# Altium schematic sheet [06] - MOTOR DRIVERS.SchDoc: X
size A4; Date: DD-MM-YYYY; CheckedBy: X; DrawnBy: Y; Revision: 0.0.0; SheetNumber: X; SheetTotal: Y; Projectnumber: OWN-000; Size: A4; Contact: datasystem.pl; Projectname: X
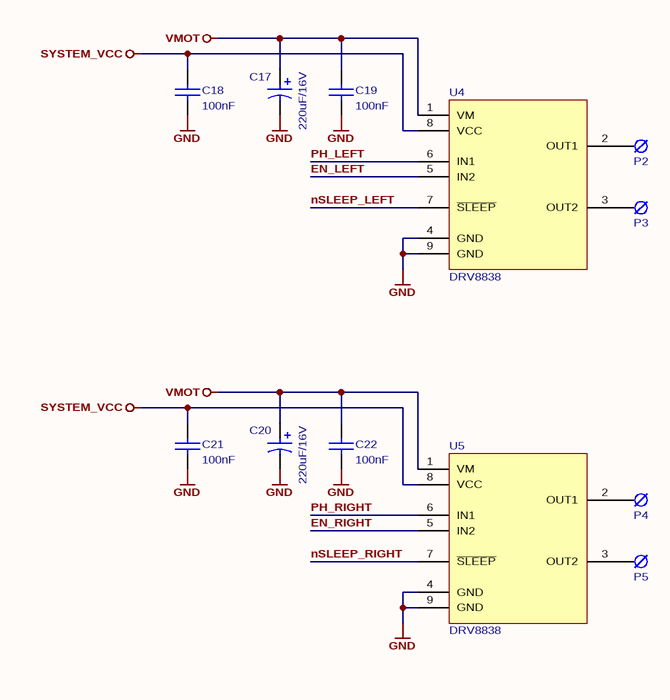
[diagram p0: [06] - MOTOR DRIVERS.SchDoc]

## Parts
C17  220uF/16V  [CES_E_8.3x8.3_6.2]
C18  100nF  [C0805]
C19  100nF  [C0805]
C20  220uF/16V  [CES_E_8.3x8.3_6.2]
C21  100nF  [C0805]
C22  100nF  [C0805]
P2  CablePAD  [PADTHT1.5x3mm]  (value not drawn)  (no BOM)
P3  CablePAD  [PADTHT1.5x3mm]  (value not drawn)  (no BOM)
P4  CablePAD  [PADTHT1.5x3mm]  (value not drawn)  (no BOM)
P5  CablePAD  [PADTHT1.5x3mm]  (value not drawn)  (no BOM)
U4  DRV8838  [WSON8 (DSG8-1600X900TP)]
U5  DRV8838  [WSON8 (DSG8-1600X900TP)]

## Nets
GND: C17.2 C18.1 C19.1 C20.2 C21.1 C22.1 U4.4(GND) U4.9(GND) U5.4(GND) U5.9(GND)
SYSTEM_VCC: C18.2 C21.2 U4.8(VCC) U5.8(VCC)
VMOT: C17.1 C19.2 C20.1 C22.2 U4.1(VM) U5.1(VM)
EN_LEFT: U4.5(IN2)
EN_RIGHT: U5.5(IN2)
nSLEEP_LEFT: U4.7(~{SLEEP})
nSLEEP_RIGHT: U5.7(~{SLEEP})
PH_LEFT: U4.6(IN1)
PH_RIGHT: U5.6(IN1)
NetP2_0: P2.0 U4.2(OUT1)
NetP3_0: P3.0 U4.3(OUT2)
NetP4_0: P4.0 U5.2(OUT1)
NetP5_0: P5.0 U5.3(OUT2)

## Notes on the sheet
- REV:
- A  P  P  R  O  V  E  D
- /
- Lodz University of Technology
- ul. Wolczanska 211/215
- 90-924 LODZ, POLAND
- Institute of Electronics
- Project name:
- Title:
- Author:
- Verified by:

## Library data of the parts
C17 C20 = Cap Pol: Polarized Capacitor; ComponentLink1Description: datasheet; ComponentLink2Description: supplier; Value: 220uF/16V
C18 C19 C21 C22 = Cap: Capacitor; ComponentLink1Description: datasheet; ComponentLink2Description: supplier; Value: 100nF
P2-P5 = CablePAD: Cable/Wire Soldering PAD; Published: 14-Sep-2006
U4 U5 = DRV8838: Low-Voltage H-Bridge Driver; Published: 14-Sep-2006; Supplier 1: Farnell; Supplier 2: Farnell; Supplier Part Number 1: 2420232; Supplier Part Number 2: 2542736